# Altium schematic sheet XT30JACK.SchDoc
size A4; SheetNumber: 1; SheetTotal: 2; SPICEModelCacheTMYVWUSJ: <root> / <DocumentId>TMYVWUSJ</DocumentId> / <CacheFrame Number="0"> / <Model Name="zener" Kind="MDL"> / <Text>*ZENER / *Default Zener 10V @ 10mA / *Zener Diode Pinout: A,K / .MODEL ZENER D( BV=10 IBV=10E-3 )</Text> / </Model> / </CacheFrame> / </root>
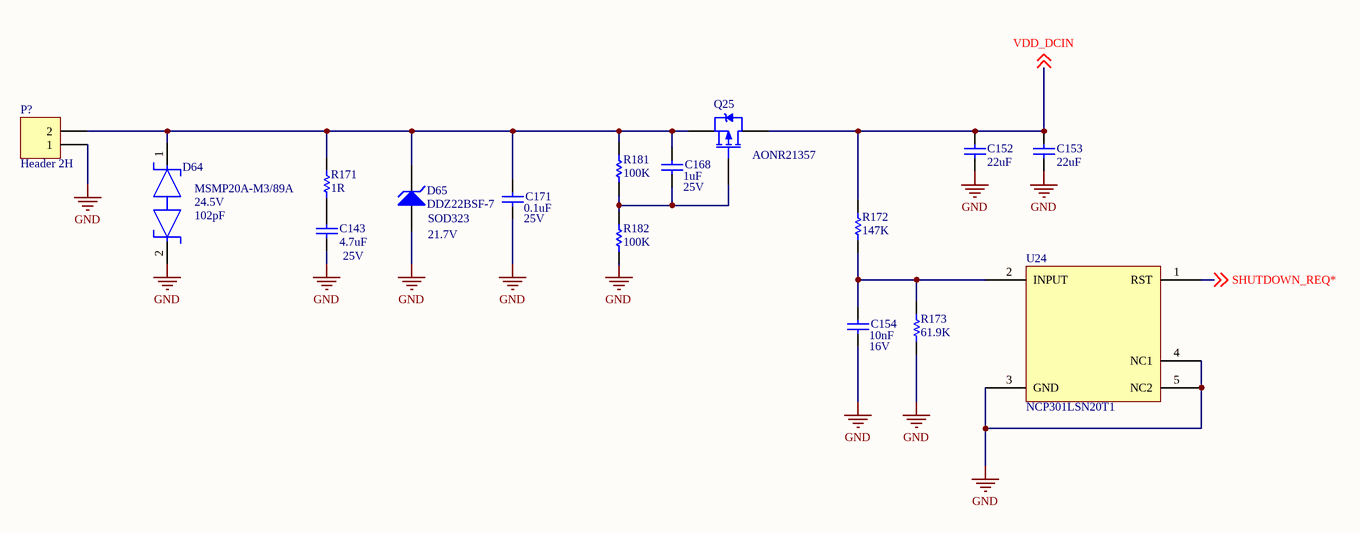
[diagram p0: XT30JACK.SchDoc]

## Parts
C143  4.7uF  Tolerance: 25V
C152  22uF
C153  22uF
C154  Tolerance: 16V  (hidden comment: 10nF)
C168  Tolerance: 25V  (hidden comment: 1uF)
C171  Tolerance: 25V  (hidden comment: 0.1uF)
D64  MSMP20A-M3/89A  Working Voltage: 24.5V  Capacitance: 102pF  [MSMP20A-M3/89A]
D65  DDZ22BSF-7  PackageDescription: SOD323  Parameter 1: 21.7V  [DIODE-0.7]
P?  Header 2H  [HDR1X2H]
Q25  AONR21357  [AONR21357]
R171  1R
R172  147K
R173  61.9K
R181  100K
R182  100K
U24  NCP301LSN20T1

## Nets
GND: C143.1 C152.2 C153.2 C154.1 C171.1 D64.2 D65.1(A) P?.1 R173.1 R182.1 U24.3(GND) U24.4(NC1) U24.5(NC2)
SHUTDOWN_REQ*: U24.1(RST) ; off-sheet SHUTDOWN_REQ*
VDD_DCIN: C152.1 C153.1 Q25.2(D) R172.2 ; off-sheet VDD_DCIN
NetC143_2: C143.2 R171.1
NetC154_2: C154.2 R172.1 R173.2 U24.2(INPUT)
NetC168_1: C168.1 Q25.1(G) R181.1 R182.2
NetC168_2: C168.2 C171.2 D64.1 D65.2(K) P?.2 Q25.3(S) R171.2 R181.2

## Library data of the parts
C143 C152-C154 C168 C171 = Capacitor: Voltage Rating (DC): *
  C152 C153: Tolerance: *; Capacitance: 22uF
  C154: Capacitance: 10nF
  C168: Capacitance: 1uF
  C171: Capacitance: 0.1uF
D64 = TVS DIODE: Leakage Current: 100nA; Min Breakdown Voltage: 6V; Number of Channels: 1; ESD Protection: Yes; Power Line Protection: No; Test Current: 1mA; Interface: GPIO; Element Configuration: Single; Peak Pulse Current: 5A; Direction: Bidirectional; Clamping Voltage: 14V; Peak Pulse Power: 90W; Composition: Zener; Packaging: Tape and Reel; Number of Pins: 2; Breakdown Voltage: 6V; Radiation Hardening: No; Min Operating Temperature: -40°C; Contact Plating: Gold; Lead Free: Lead Free; Height: 0.35mm; REACH SVHC: No SVHC; Case/Package: 0402; Max Operating Temperature: 125°C; Width: 0.7mm; Package Quantity: 1; Max Reverse Leakage Current: 100nA; Length: 1.1mm; Number of Bidirectional Channels: 1; Reverse Standoff Voltage: 24.5V
D65 = D Zener: Zener Diode
P? = Header 2H: Header, 2-Pin, Right Angle; LatestRevisionDate: 17-Jul-2002; LatestRevisionNote: Re-released for DXP Platform.; Publisher: Altium Limited
Q25 = PMOS-2: P-Channel Power MOSFET; ComponentLink1Description: Manufacturer Link; ComponentLink1URL: http://www.irf.com/
R171-R173 R181 R182 = Resistor: Power Rating: *; Tolerance: *
  R171: Resistance: 1R
  R172: Resistance: 147K
  R173: Resistance: 61.9K
  R181 R182: Resistance: 100K